# EAGLE schematic ramanPi_imagingBoard_ccdBoard (EAGLE 6.2)
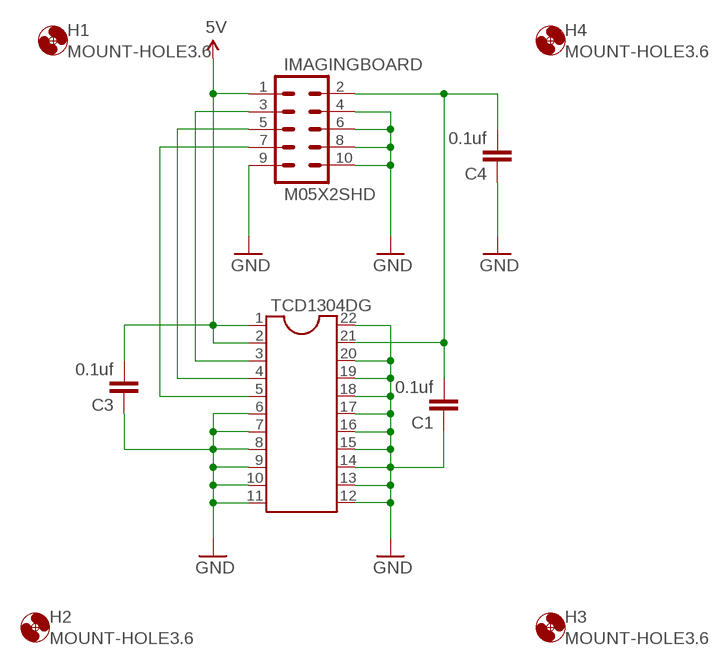
[diagram p0: schematic, sheet 1]

## Parts
C1  0.1uf  CAP1210  [1210]
C3  0.1uf  CAP1210  [1210]
C4  0.1uf  CAP1210  [1210]
H1  MOUNT-HOLE3.6  [3,6]
H2  MOUNT-HOLE3.6  [3,6]
H3  MOUNT-HOLE3.6  [3,6]
H4  MOUNT-HOLE3.6  [3,6]
IMAGINGBOARD  M05X2SHD  [2X5-SHROUDED]
TCD1304DG  DIL22-4  [DIL22-4]

## Nets
5V: C3.2 IMAGINGBOARD.1 TCD1304DG.1 TCD1304DG.2
GND: C1.1 C3.1 C4.1 IMAGINGBOARD.4 IMAGINGBOARD.6 IMAGINGBOARD.8 IMAGINGBOARD.9 IMAGINGBOARD.10 TCD1304DG.6 TCD1304DG.7 TCD1304DG.8 TCD1304DG.9 TCD1304DG.10 TCD1304DG.11 TCD1304DG.12 TCD1304DG.13 TCD1304DG.14 TCD1304DG.15 TCD1304DG.16 TCD1304DG.17 TCD1304DG.18 TCD1304DG.19 TCD1304DG.20 TCD1304DG.22
N$1: C1.2 C4.2 IMAGINGBOARD.2 TCD1304DG.21
N$2: IMAGINGBOARD.5 TCD1304DG.4
N$3: IMAGINGBOARD.7 TCD1304DG.5
N$7: IMAGINGBOARD.3 TCD1304DG.3

## Library data of the parts
C1 C3 C4 = SparkFun-Passives:CAP: Capacitor Standard 0603 ceramic capacitor, and 0.1" leaded capacitor.
H1-H4 = holes:MOUNT-HOLE: MOUNTING HOLE with drill center marker
IMAGINGBOARD = SparkFun-Connectors:M05X2: Header 5x2 Standard 10-pin dual row 0.1" header. Commonly used with AVR-ISP. Use with Spark Fun Electronics SKU: PRT-00778
TCD1304DG = ic-package:DIL22: Dual In Line / Socket